# Altium schematic sheet RGB_FPGA_CSI.SchDoc
size A4
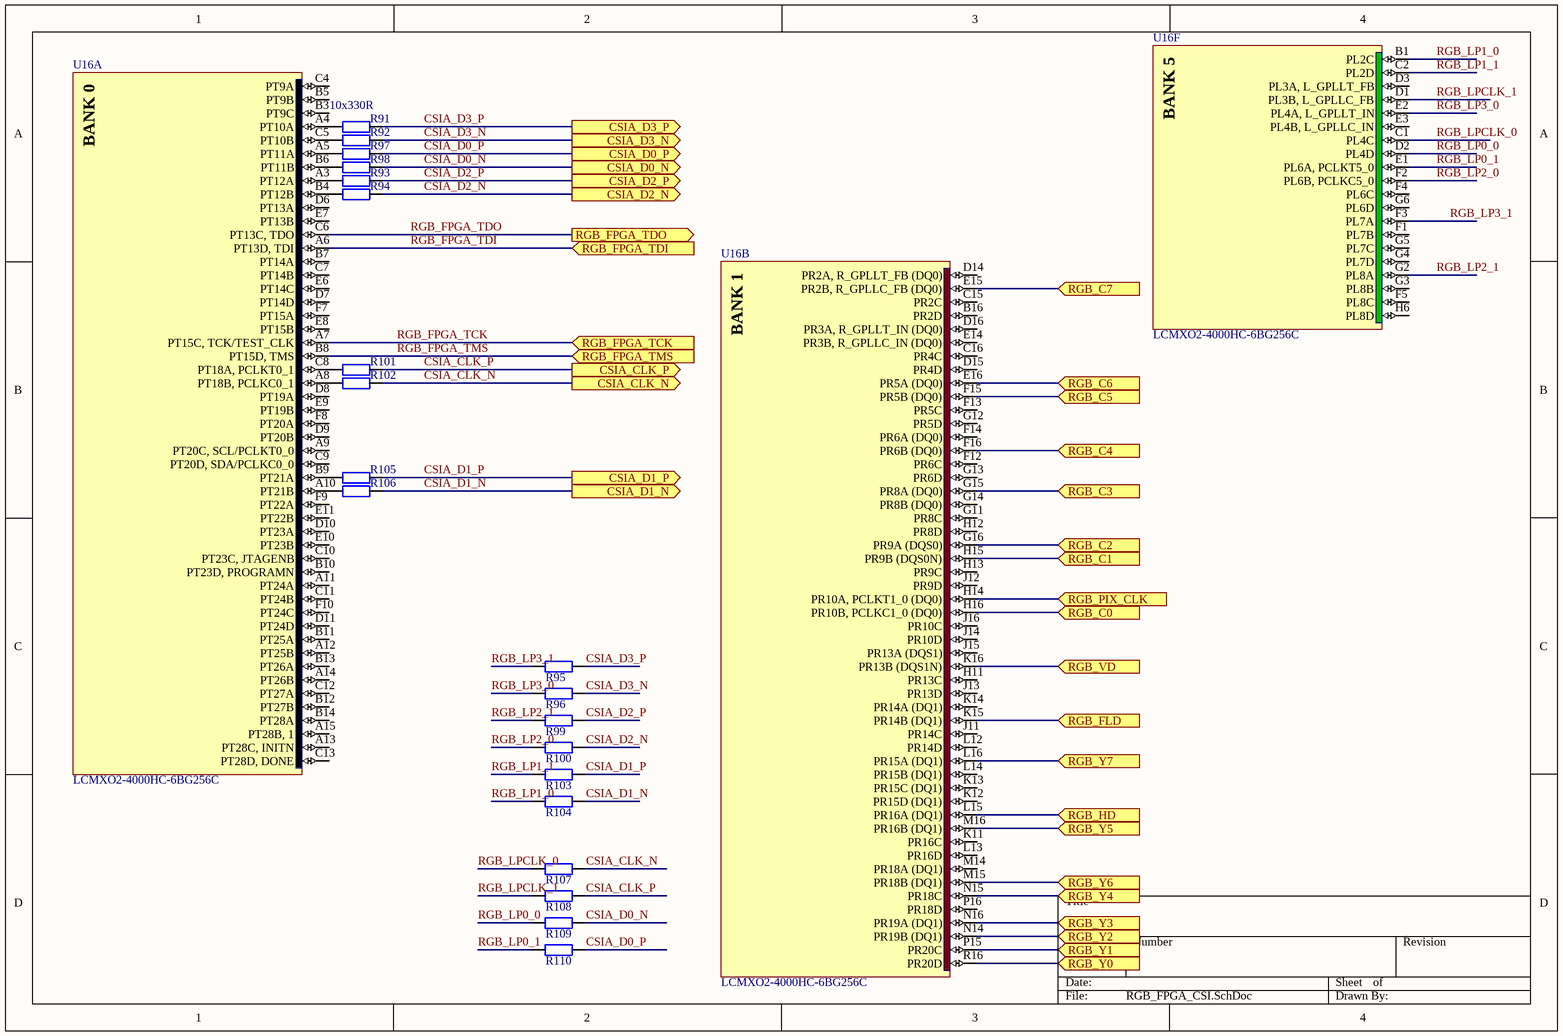
[diagram p0: RGB_FPGA_CSI.SchDoc]

## Parts
R91  CRCW0402330RFKED  [0402R_M]  (value not drawn)
R92  CRCW0402330RFKED  [0402R_M]  (value not drawn)
R93  CRCW0402330RFKED  [0402R_M]  (value not drawn)
R94  CRCW0402330RFKED  [0402R_M]  (value not drawn)
R95  CRCW040249R9FKED  [0402R_M]  (value not drawn)
R96  CRCW040249R9FKED  [0402R_M]  (value not drawn)
R97  CRCW0402330RFKED  [0402R_M]  (value not drawn)
R98  CRCW0402330RFKED  [0402R_M]  (value not drawn)
R99  CRCW040249R9FKED  [0402R_M]  (value not drawn)
R100  CRCW040249R9FKED  [0402R_M]  (value not drawn)
R101  CRCW0402330RFKED  [0402R_M]  (value not drawn)
R102  CRCW0402330RFKED  [0402R_M]  (value not drawn)
R103  CRCW040249R9FKED  [0402R_M]  (value not drawn)
R104  CRCW040249R9FKED  [0402R_M]  (value not drawn)
R105  CRCW0402330RFKED  [0402R_M]  (value not drawn)
R106  CRCW0402330RFKED  [0402R_M]  (value not drawn)
R107  CRCW040249R9FKED  [0402R_M]  (value not drawn)
R108  CRCW040249R9FKED  [0402R_M]  (value not drawn)
R109  CRCW040249R9FKED  [0402R_M]  (value not drawn)
R110  CRCW040249R9FKED  [0402R_M]  (value not drawn)
U16  LCMXO2-4000HC-6BG256C  [caBGA256]  (parts A,B,F of 8)

## Ports
CSIA_CLK_N (out), CSIA_CLK_P (out), CSIA_D0_N (out), CSIA_D0_P (out), CSIA_D1_N (out), CSIA_D1_P (out), CSIA_D2_N (out), CSIA_D2_P (out), CSIA_D3_N (out), CSIA_D3_P (out), RGB_C0 (in), RGB_C1 (in), RGB_C2 (in), RGB_C3 (in), RGB_C4 (in), RGB_C5 (in), RGB_C6 (in), RGB_C7 (in), RGB_FLD (in), RGB_FPGA_TCK (in), RGB_FPGA_TDI (in), RGB_FPGA_TDO (out), RGB_FPGA_TMS (in), RGB_HD (in), RGB_PIX_CLK (in), RGB_VD (in), RGB_Y0 (in), RGB_Y1 (in), RGB_Y2 (in), RGB_Y3 (in), RGB_Y4 (in), RGB_Y5 (in), RGB_Y6 (in), RGB_Y7 (in)

## Nets
CSIA_CLK_N: R102.2 R107.2 ; port CSIA_CLK_N
CSIA_CLK_P: R101.2 R108.2 ; port CSIA_CLK_P
CSIA_D0_N: R98.2 R109.2 ; port CSIA_D0_N
CSIA_D0_P: R97.2 R110.2 ; port CSIA_D0_P
CSIA_D1_N: R104.1 R106.2 ; port CSIA_D1_N
CSIA_D1_P: R103.1 R105.2 ; port CSIA_D1_P
CSIA_D2_N: R94.2 R100.1 ; port CSIA_D2_N
CSIA_D2_P: R93.2 R99.1 ; port CSIA_D2_P
CSIA_D3_N: R92.2 R96.1 ; port CSIA_D3_N
CSIA_D3_P: R91.2 R95.1 ; port CSIA_D3_P
RGB_C0: U16.H16(PR10B,_PCLKC1_0_(DQ0)) ; port RGB_C0
RGB_C1: U16.H15(PR9B_(DQS0N)) ; port RGB_C1
RGB_C2: U16.G16(PR9A_(DQS0)) ; port RGB_C2
RGB_C3: U16.G15(PR8A_(DQ0)) ; port RGB_C3
RGB_C4: U16.F16(PR6B_(DQ0)) ; port RGB_C4
RGB_C5: U16.F15(PR5B_(DQ0)) ; port RGB_C5
RGB_C6: U16.E16(PR5A_(DQ0)) ; port RGB_C6
RGB_C7: U16.E15(PR2B,_R_GPLLC_FB_(DQ0)) ; port RGB_C7
RGB_FLD: U16.K15(PR14B_(DQ1)) ; port RGB_FLD
RGB_FPGA_TCK: U16.A7(PT15C,_TCK/TEST_CLK) ; port RGB_FPGA_TCK
RGB_FPGA_TDI: U16.A6(PT13D,_TDI) ; port RGB_FPGA_TDI
RGB_FPGA_TDO: U16.C6(PT13C,_TDO) ; port RGB_FPGA_TDO
RGB_FPGA_TMS: U16.B8(PT15D,_TMS) ; port RGB_FPGA_TMS
RGB_HD: U16.L15(PR16A_(DQ1)) ; port RGB_HD
RGB_LP0_0: R109.1 U16.D2(PL4D)
RGB_LP0_1: R110.1 U16.E1(PL6A,_PCLKT5_0)
RGB_LP1_0: R104.2 U16.B1(PL2C)
RGB_LP1_1: R103.2 U16.C2(PL2D)
RGB_LP2_0: R100.2 U16.F2(PL6B,_PCLKC5_0)
RGB_LP2_1: R99.2 U16.G2(PL8A)
RGB_LP3_0: R96.2 U16.E2(PL4A,_L_GPLLT_IN)
RGB_LP3_1: R95.2 U16.F3(PL7A)
RGB_LPCLK_0: R107.1 U16.C1(PL4C)
RGB_LPCLK_1: R108.1 U16.D1(PL3B,_L_GPLLC_FB)
RGB_PIX_CLK: U16.H14(PR10A,_PCLKT1_0_(DQ0)) ; port RGB_PIX_CLK
RGB_VD: U16.K16(PR13B_(DQS1N)) ; port RGB_VD
RGB_Y0: U16.R16(PR20D) ; port RGB_Y0
RGB_Y1: U16.P15(PR20C) ; port RGB_Y1
RGB_Y2: U16.N14(PR19B_(DQ1)) ; port RGB_Y2
RGB_Y3: U16.N16(PR19A_(DQ1)) ; port RGB_Y3
RGB_Y4: U16.N15(PR18C) ; port RGB_Y4
RGB_Y5: U16.M16(PR16B_(DQ1)) ; port RGB_Y5
RGB_Y6: U16.M15(PR18B_(DQ1)) ; port RGB_Y6
RGB_Y7: U16.L16(PR15A_(DQ1)) ; port RGB_Y7
NetR91_1: R91.1 U16.A4(PT10A)
NetR92_1: R92.1 U16.C5(PT10B)
NetR93_1: R93.1 U16.A3(PT12A)
NetR94_1: R94.1 U16.B4(PT12B)
NetR97_1: R97.1 U16.A5(PT11A)
NetR98_1: R98.1 U16.B6(PT11B)
NetR101_1: R101.1 U16.C8(PT18A,_PCLKT0_1)
NetR102_1: R102.1 U16.A8(PT18B,_PCLKC0_1)
NetR105_1: R105.1 U16.B9(PT21A)
NetR106_1: R106.1 U16.A10(PT21B)

Not connected (* = marked no-connect by the designer): U16 A9(PT20C,_SCL/PCLKT0_0) A11(PT24A) A12(PT25B) A13(PT28C,_INITN) A14(PT26B) A15(PT28B,_1) B3(PT9C) B5(PT9B) B7(PT14A) B10(PT23D,_PROGRAMN) B11(PT25A) B12(PT27B) B13(PT26A) B14(PT28A) B16(PR2D) C4(PT9A) C7(PT14B) C9(PT20D,_SDA/PCLKC0_0) C10(PT23C,_JTAGENB) C11(PT24B) C12(PT27A) C13(PT28D,_DONE) C15(PR2C) C16(PR4C) D3(PL3A,_L_GPLLT_FB) D6(PT13A) D7(PT14D) D8(PT19A) D9(PT20B) D10(PT23A) D11(PT24D) D14(PR2A,_R_GPLLT_FB_(DQ0)) D15(PR4D) D16(PR3A,_R_GPLLT_IN_(DQ0)) E3(PL4B,_L_GPLLC_IN) E6(PT14C) E7(PT13B) E8(PT15B) E9(PT19B) E10(PT23B) E11(PT22B) E14(PR3B,_R_GPLLC_IN_(DQ0)) F1(PL7B) F4(PL6C) F5(PL8C) F7(PT15A) F8(PT20A) F9(PT22A) F10(PT24C) F12(PR6C) F13(PR5C) F14(PR6A_(DQ0)) G3(PL8B) G4(PL7D) G5(PL7C) G6(PL6D) G11(PR8C) G12(PR5D) G13(PR6D) G14(PR8B_(DQ0)) H6(PL8D) H11(PR13C) H12(PR8D) H13(PR9C) J11(PR14C) J12(PR9D) J13(PR13D) J14(PR10D) J15(PR13A_(DQS1)) J16(PR10C) K11(PR16C) K12(PR15D_(DQ1)) K13(PR15C_(DQ1)) K14(PR14A_(DQ1)) L12(PR14D) L13(PR16D) L14(PR15B_(DQ1)) M14(PR18A_(DQ1)) P16(PR18D)

## Notes on the sheet
- (near R91) 10x330R
- (in symbol CMP-0111-00181-1, part A) BANK 0
- (in symbol CMP-0111-00181-1, part B) BANK 1
- (in symbol CMP-0111-00181-1, part F) BANK 5

## Library data of the parts
R91-R94 R97 R98 R101 R102 R105 R106 = CRCW0402330RFKED: RES SMD 330 OHM 1% 1/16W 0402; Manufacturer: Vishay Dale; Power (Watts): 0.063W, 1/16W; Temperature Coefficient: ±100ppm/°C; Value: 330R; Supplier 1: Digi-Key; Manufacturer Part Number: CRCW0402330RFKED; RoHS: RoHS Compliant; Category: Resistors; Stock 1: 346239; Pricing 1: 1=0.1, 10=0.037, 100=0.0149, 1000=0.0067, 2500=0.00582, 5000=0.00481 (USD); Packaging: Cut Tape (CT); Part Status: Active; Tolerance: ±1%; Composition: Thick Film; Features: Automotive AEC-Q200; Operating Temperature: -55°C ~ 155°C; Package / Case: 0402 (1005 Metric); Supplier Device Package: 0402; Size / Dimension: 0.039" L x 0.020" W (1.00mm x 0.50mm); Height - Seated (Max): 0.016" (0.40mm); Failure Rate: -; ComponentLink1URL: http://www.vishay.com/docs/20035/dcrcwe3.pdf; ComponentLink1Description: http://www.vishay.com/docs/20035/dcrcwe3.pdf; Supplier Part Number 1: 541-330LCT-ND
R95 R96 R99 R100 R103 R104 R107-R110 = CRCW040249R9FKED: RES SMD 49.9 OHM 1% 1/16W 0402; Manufacturer: Vishay Dale; Power (Watts): 0.063W, 1/16W; Temperature Coefficient: ±100ppm/°C; Supplier 1: Digi-Key; Manufacturer Part Number: CRCW040249R9FKED; RoHS: RoHS Compliant; Category: Resistors; Stock 1: 0; Pricing 1: 1=0.1, 10=0.037, 100=0.0149, 1000=0.0067, 2500=0.00582, 5000=0.00481 (USD); Packaging: Cut Tape (CT); Part Status: Active; Tolerance: ±1%; Composition: Thick Film; Features: Automotive AEC-Q200; Operating Temperature: -55°C ~ 155°C; Package / Case: 0402 (1005 Metric); Supplier Device Package: 0402; Size / Dimension: 0.039" L x 0.020" W (1.00mm x 0.50mm); Height - Seated (Max): 0.016" (0.40mm); Failure Rate: -; ComponentLink1URL: http://www.vishay.com/docs/20035/dcrcwe3.pdf; ComponentLink1Description: http://www.vishay.com/docs/20035/dcrcwe3.pdf; Supplier Part Number 1: 541-49.9LCT-ND
U16 = CMP-0111-00181-1: MachXO2 High Performance CPLD with 4320 LUTs, Voltage Regulator, 2.5V/3.3V, 256-pin caBGA, Speed Grade-6, Commercial Grade, Halogen Free (RoHS); PackageDescription: 256-Ball caBGA Package, 14 x 14 mm Body, 0.8 mm Pitch; DatasheetVersion: ver01.0, Nov-2010; PackageReference: caBGA256; PackageVersion: ver02.6, Nov-2010; Code_JEDEC: MO-275-JJAB-2; PartId: 1